# EAGLE design pypl (EAGLE 9.6.2)
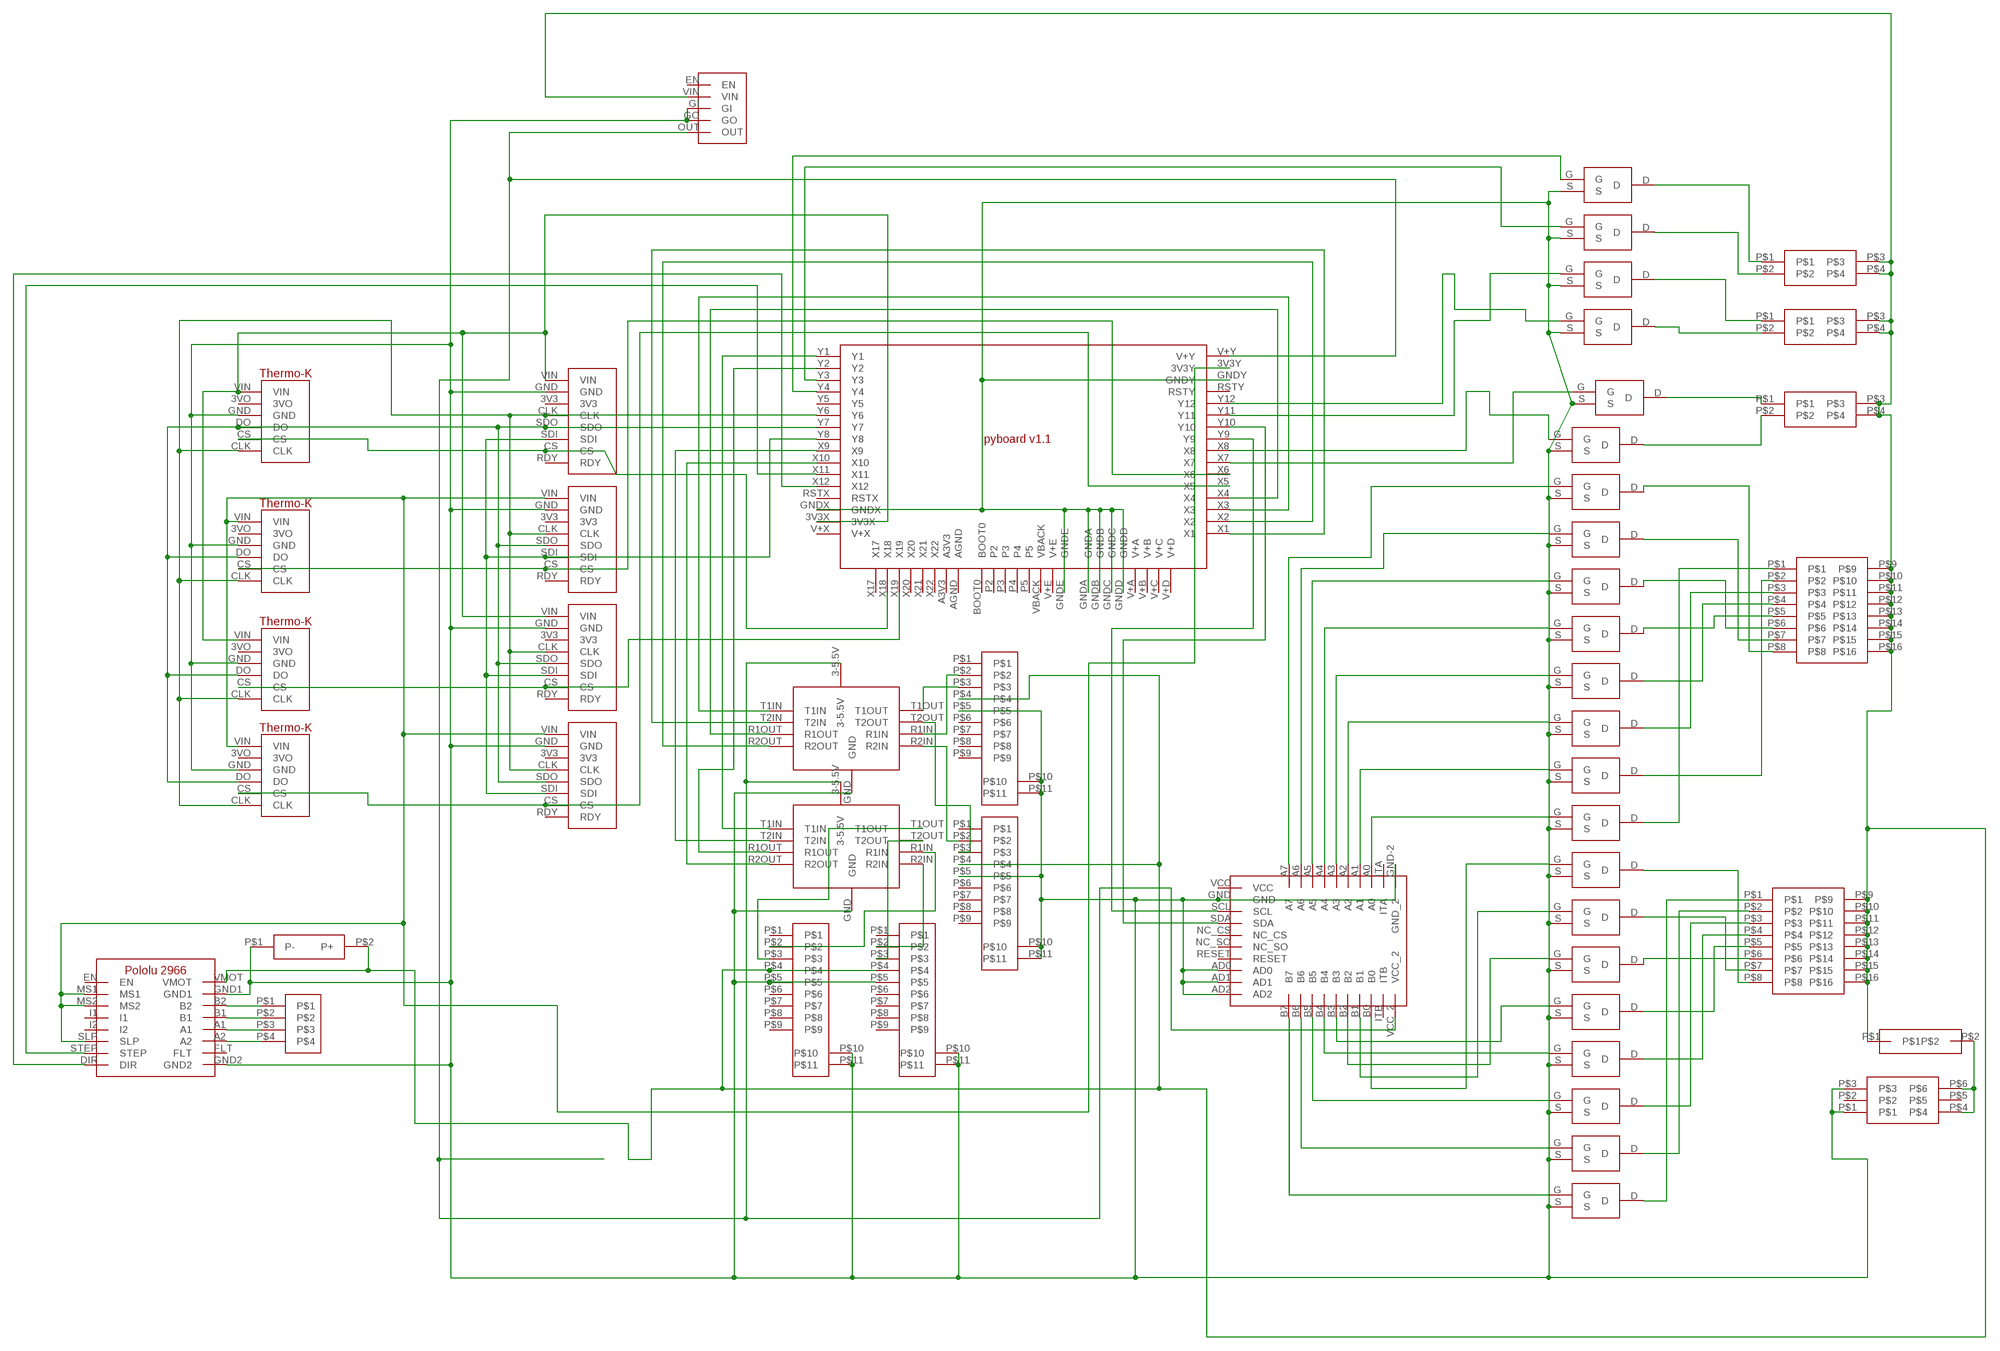
[diagram p0: schematic, sheet 1]

## Parts
U$1  MAX31865  [MAX31865]
U$2  IRLB8721PBF  [IRLB8721PBF]
U$3  IRLB8721PBF  [IRLB8721PBF]
U$4  IRLB8721PBF  [IRLB8721PBF]
U$5  IRLB8721PBF  [IRLB8721PBF]
U$6  IRLB8721PBF  [IRLB8721PBF]
U$7  IRLB8721PBF  [IRLB8721PBF]
U$8  IRLB8721PBF  [IRLB8721PBF]
U$9  IRLB8721PBF  [IRLB8721PBF]
U$10  MCP23017  [MCP23017]
U$11  IRLB8721PBF  [IRLB8721PBF]
U$12  IRLB8721PBF  [IRLB8721PBF]
U$13  IRLB8721PBF  [IRLB8721PBF]
U$14  IRLB8721PBF  [IRLB8721PBF]
U$15  IRLB8721PBF  [IRLB8721PBF]
U$16  IRLB8721PBF  [IRLB8721PBF]
U$17  IRLB8721PBF  [IRLB8721PBF]
U$18  IRLB8721PBF  [IRLB8721PBF]
U$19  DSUB-9  [DSUB-9]
U$20  DSUB-9  [DSUB-9]
U$21  DSUB-9  [DSUB-9]
U$22  DSUB-9  [DSUB-9]
U$23  MAX31865  [MAX31865]
U$24  PYBOARD_V1.1  [PYBOARD_V1.1]
U$25  MAX31865  [MAX31865]
U$26  MAX31865  [MAX31865]
U$27  BORNIER_DUPLEX_X16  [BORNIER_DUPLEX_X16]
U$28  BORNIER_DUPLEX_X16  [BORNIER_DUPLEX_X16]
U$29  CAP-GOTRONIC-04936  [CAP-GOTRONIC-04936]
U$30  BORNIER_1X4_2.54  [BORNIER_1X4_2.54]
U$31  PORTE-FUSIBLE  [PORTE-FUSIBLE]
U$32  MP6500-2966  [MP6500-2966]
U$33  IRLB8721PBF  [IRLB8721PBF]
U$34  IRLB8721PBF  [IRLB8721PBF]
U$35  BORNIER_DUPLEX_X4  [BORNIER_DUPLEX_X4]
U$36  BOB-1189  [BOB-11189]
U$37  BOB-1189  [BOB-11189]
U$38  MOLEX_MINIFT_JR_ANGLED_X6  [MOLEX_MINIFT_JR_ANGLED_X6]
U$39  D24V50F5D24V50F5  [D24V50F5]
U$40  BORNIER_DUPLEX_X4  [BORNIER_DUPLEX_X4]
U$41  BORNIER_DUPLEX_X4  [BORNIER_DUPLEX_X4]
U$42  IRLB8721PBF  [IRLB8721PBF]
U$43  IRLB8721PBF  [IRLB8721PBF]
U$44  IRLB8721PBF  [IRLB8721PBF]
U$45  IRLB8721PBF  [IRLB8721PBF]
U$46  MAX31855  [MAX31855]
U$47  MAX31855  [MAX31855]
U$48  MAX31855  [MAX31855]
U$49  MAX31855  [MAX31855]

## Nets
GND: U$1.GND U$2.S U$3.S U$4.S U$5.S U$6.S U$7.S U$8.S U$9.S U$10.AD0 U$10.AD1 U$10.AD2 U$10.GND U$10.GND-2(GND_2) U$11.S U$12.S U$13.S U$14.S U$15.S U$16.S U$17.S U$18.S U$19.P$5 U$19.P$10 U$19.P$11 U$20.P$5 U$20.P$10 U$20.P$11 U$21.P$5 U$21.P$10 U$21.P$11 U$22.P$5 U$22.P$10 U$22.P$11 U$23.GND U$24.GNDA U$24.GNDB U$24.GNDC U$24.GNDD U$24.GNDE U$24.GNDX U$24.GNDY U$25.GND U$26.GND U$29.P$1(P-) U$32.GND1 U$32.GND2 U$33.S U$34.S U$36.GND U$37.GND U$38.P$1 U$38.P$3 U$39.GI U$39.GO U$42.S U$43.S U$44.S U$45.S U$46.GND U$47.GND U$48.GND U$49.GND
N$1: U$24.X12 U$32.DIR
N$2: U$10.SDA U$24.Y10
N$3: U$10.SCL U$24.Y9
N$4: U$24.X4 U$36.R1OUT
N$5: U$24.X3 U$36.T1IN
N$6: U$24.X2 U$36.R2OUT
N$7: U$24.X1 U$36.T2IN
N$8: U$24.Y1 U$37.T1IN
N$9: U$24.Y2 U$37.R1OUT
N$10: U$24.X10 U$37.R2OUT
N$11: U$24.X9 U$37.T2IN
N$12: U$1.CLK U$23.CLK U$24.Y6 U$25.CLK U$26.CLK U$46.CLK U$47.CLK U$48.CLK U$49.CLK
N$13: U$1.SDO U$23.SDO U$24.Y7 U$25.SDO U$26.SDO U$46.DO U$47.DO U$48.DO U$49.DO
N$14: U$1.SDI U$23.SDI U$24.Y8 U$25.SDI U$26.SDI
N$15: U$10.B7 U$18.G
N$16: U$4.G U$10.A4
N$17: U$7.G U$10.A7
N$18: U$6.G U$10.A6
N$19: U$5.G U$10.A5
N$20: U$3.G U$10.A3
N$21: U$2.G U$10.A2
N$22: U$8.G U$10.A1
N$23: U$9.G U$10.A0
N$24: U$10.B6 U$17.G
N$25: U$10.B5 U$11.G
N$26: U$10.B4 U$12.G
N$27: U$10.B3 U$13.G
N$28: U$10.B2 U$14.G
N$29: U$10.B1 U$15.G
N$30: U$10.B0 U$16.G
N$31: U$7.D U$28.P$8
N$32: U$6.D U$28.P$7
N$33: U$5.D U$28.P$6
N$34: U$30.P$1 U$32.B2
N$35: U$16.D U$27.P$8
N$36: U$15.D U$27.P$7
N$37: U$4.D U$28.P$5
N$38: U$3.D U$28.P$4
N$39: U$2.D U$28.P$3
N$40: U$8.D U$28.P$2
N$41: U$9.D U$28.P$1
N$42: U$14.D U$27.P$6
N$43: U$13.D U$27.P$5
N$44: U$12.D U$27.P$4
N$45: U$11.D U$27.P$3
N$46: U$17.D U$27.P$2
N$47: U$18.D U$27.P$1
N$49: U$40.P$2 U$42.D
N$50: U$10.VCC_2 U$24.V+Y U$36.3-5.5V U$37.3-5.5V U$39.OUT
N$51: U$31.P$2 U$38.P$4 U$38.P$6
N$52: U$24.X6 U$26.CS U$47.CS
N$53: U$1.CS U$24.X19 U$48.CS
N$54: U$24.X18 U$25.CS U$46.CS
N$55: U$24.X7 U$34.G
N$56: U$24.X8 U$33.G
N$57: U$33.D U$35.P$2
N$58: U$34.D U$35.P$1
N$59: U$30.P$2 U$32.B1
N$60: U$30.P$3 U$32.A1
N$61: U$30.P$4 U$32.A2
N$62: U$19.P$2 U$36.R1IN
N$63: U$20.P$2 U$36.R2IN
N$64: U$40.P$1 U$43.D
N$65: U$21.P$2 U$37.R2IN
N$66: U$22.P$2 U$37.R1IN
N$67: U$19.P$3 U$36.T1OUT
N$68: U$20.P$3 U$36.T2OUT
N$69: U$22.P$3 U$37.T1OUT
N$70: U$21.P$3 U$37.T2OUT
N$71: U$1.VIN U$24.3V3X U$25.VIN U$46.VIN U$48.VIN
N$72: U$23.CS U$24.X5 U$49.CS
N$73: U$41.P$2 U$44.D
N$75: U$19.P$4 U$20.P$4 U$21.P$4 U$22.P$4 U$27.P$9 U$27.P$10 U$27.P$11 U$27.P$12 U$27.P$13 U$27.P$14 U$27.P$15 U$27.P$16 U$28.P$9 U$28.P$10 U$28.P$11 U$28.P$12 U$28.P$13 U$28.P$14 U$28.P$15 U$28.P$16 U$29.P$2(P+) U$31.P$1 U$32.VMOT U$35.P$3 U$35.P$4 U$39.VIN U$40.P$3 U$40.P$4 U$41.P$3 U$41.P$4
N$79: U$24.X11 U$32.STEP
N$80: U$23.VIN U$24.3V3Y U$26.VIN U$32.MS1 U$32.MS2 U$32.SLP U$47.VIN U$49.VIN
N$81: U$41.P$1 U$45.D
N$82: U$24.Y11 U$43.G
N$83: U$24.Y12 U$42.G
N$84: U$24.Y3 U$44.G
N$85: U$24.Y4 U$45.G
Unconnected: U$1.3V3 U$1.RDY U$10.ITA U$10.ITB U$10.NC_CS U$10.NC_SO U$10.RESET U$10.VCC U$19.P$1 U$19.P$6 U$19.P$7 U$19.P$8 U$19.P$9 U$20.P$1 U$20.P$6 U$20.P$7 U$20.P$8 U$20.P$9 U$21.P$1 U$21.P$6 U$21.P$7 U$21.P$8 U$21.P$9 U$22.P$1 U$22.P$6 U$22.P$7 U$22.P$8 U$22.P$9 U$23.3V3 U$23.RDY U$24.A3V3 U$24.AGND U$24.BOOT0 U$24.P2 U$24.P3 U$24.P4 U$24.P5 U$24.RSTX U$24.RSTY U$24.V+A U$24.V+B U$24.V+C U$24.V+D U$24.V+E U$24.V+X U$24.VBACK U$24.X17 U$24.X20 U$24.X21 U$24.X22 U$24.Y5 U$25.3V3 U$25.RDY U$26.3V3 U$26.RDY U$32.EN U$32.FLT U$32.I1 U$32.I2 U$38.P$2 U$38.P$5 U$39.EN U$46.3VO U$47.3VO U$48.3VO U$49.3VO

## Library data of the parts
U$1 U$23 U$25 U$26 = mathieu:MAX31865
U$2-U$9 U$11-U$18 U$33 U$34 U$42-U$45 = mathieu:IRLB8721PBF
U$10 = mathieu:MCP23017
U$19-U$22 = mathieu:DSUB-9
U$24 = mathieu:PYBOARD_V1.1
U$27 U$28 = mathieu:BORNIER_DUPLEX_X16
U$29 = mathieu:CAP-GOTRONIC-04936
U$30 = mathieu:BORNIER_1X4_2.54
U$31 = mathieu:PORTE-FUSIBLE
U$32 = mathieu:MP6500-2966
U$35 U$40 U$41 = mathieu:BORNIER_DUPLEX_X4
U$36 U$37 = mathieu:BOB-1189
U$38 = mathieu:MOLEX_MINIFT_JR_ANGLED_X6
U$39 = mathieu:D24V50F5
U$46-U$49 = mathieu:MAX31855

## Board
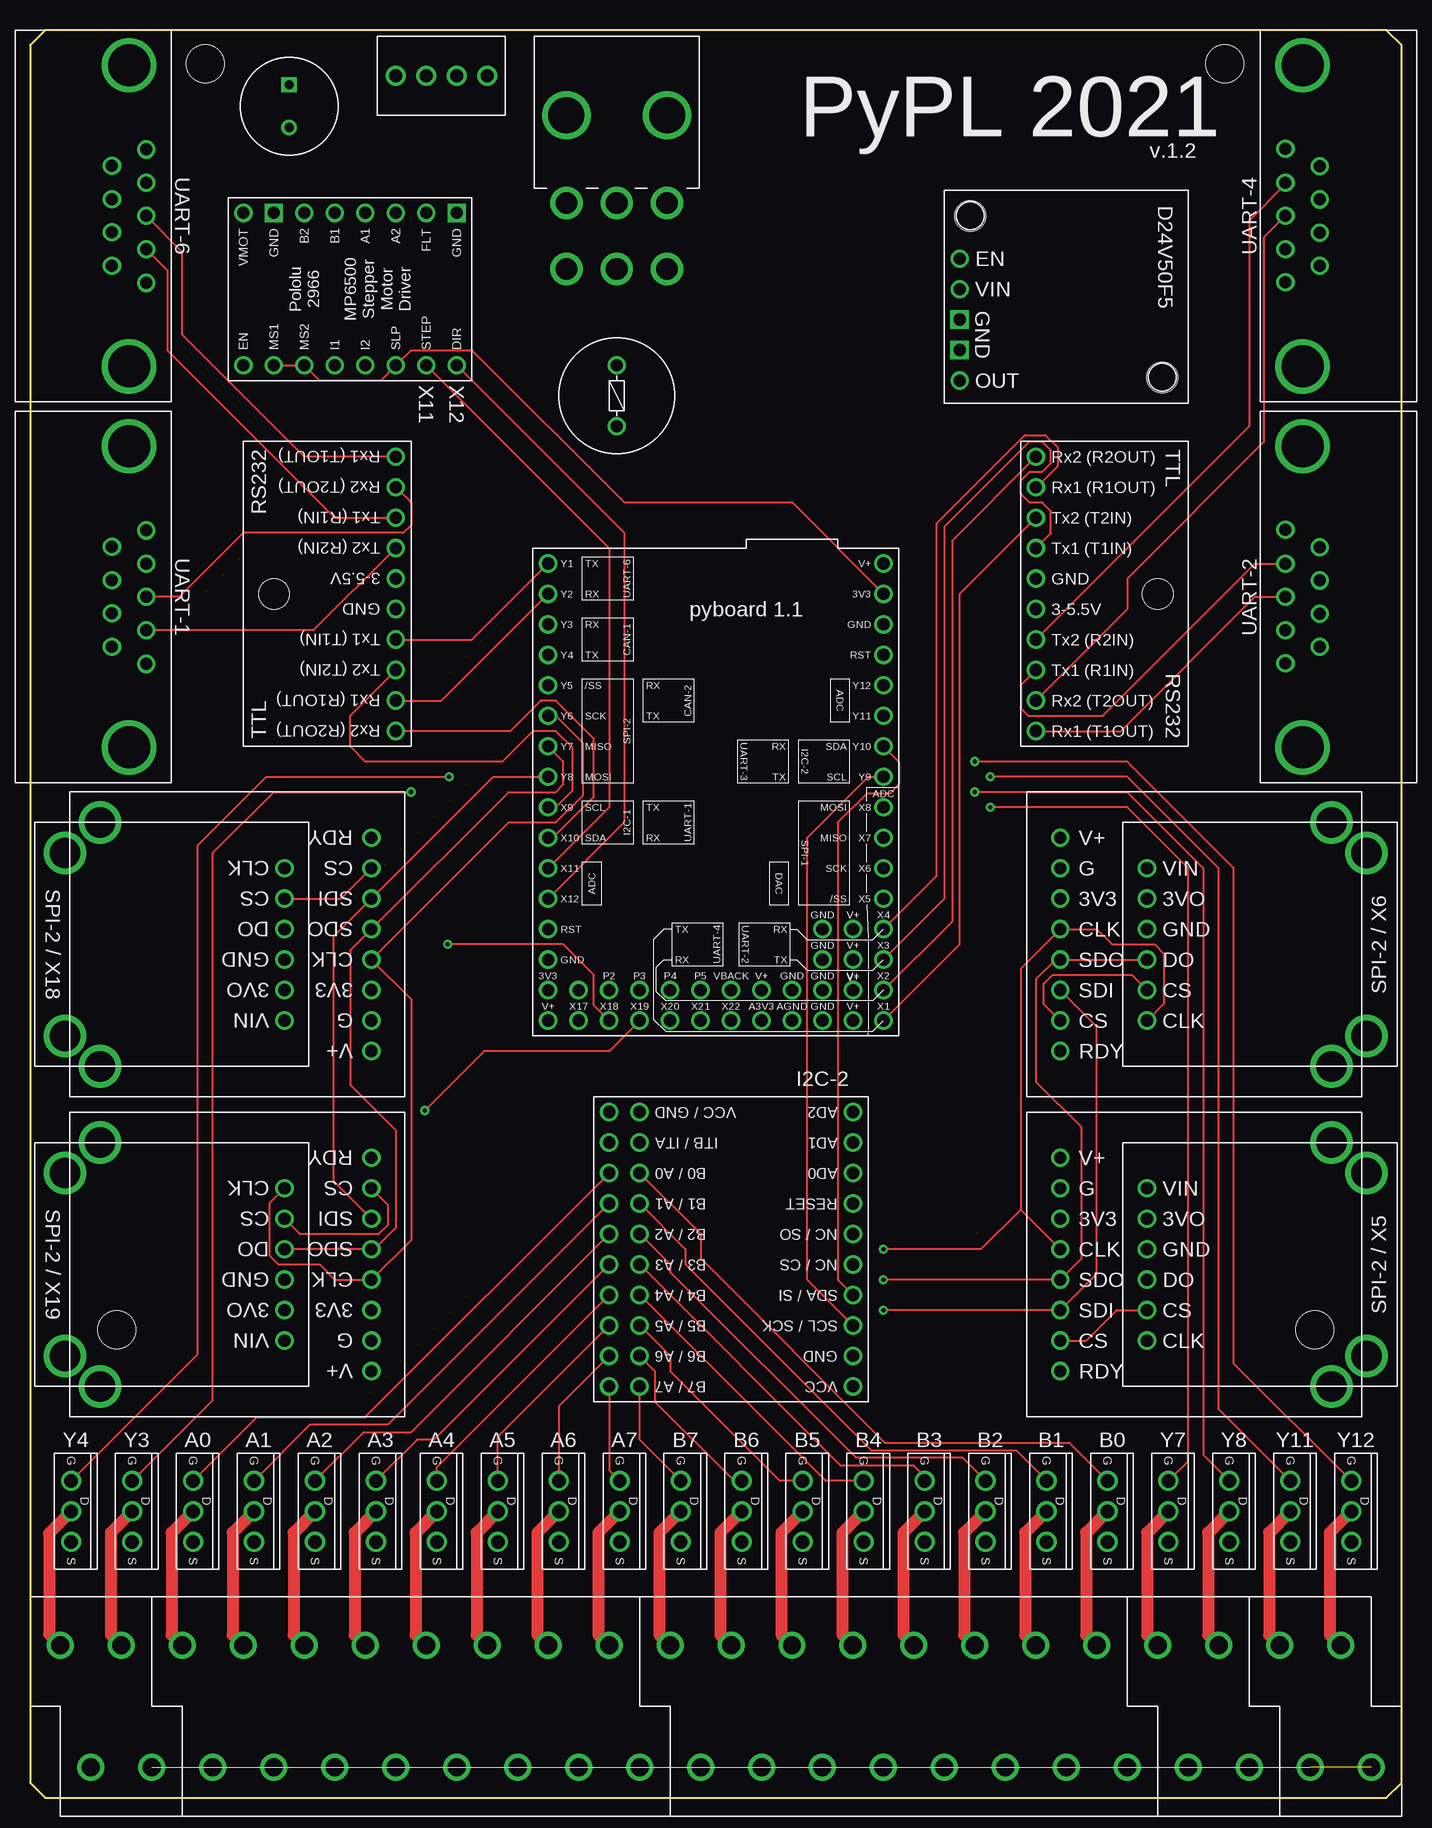
[diagram p1: board, top side]
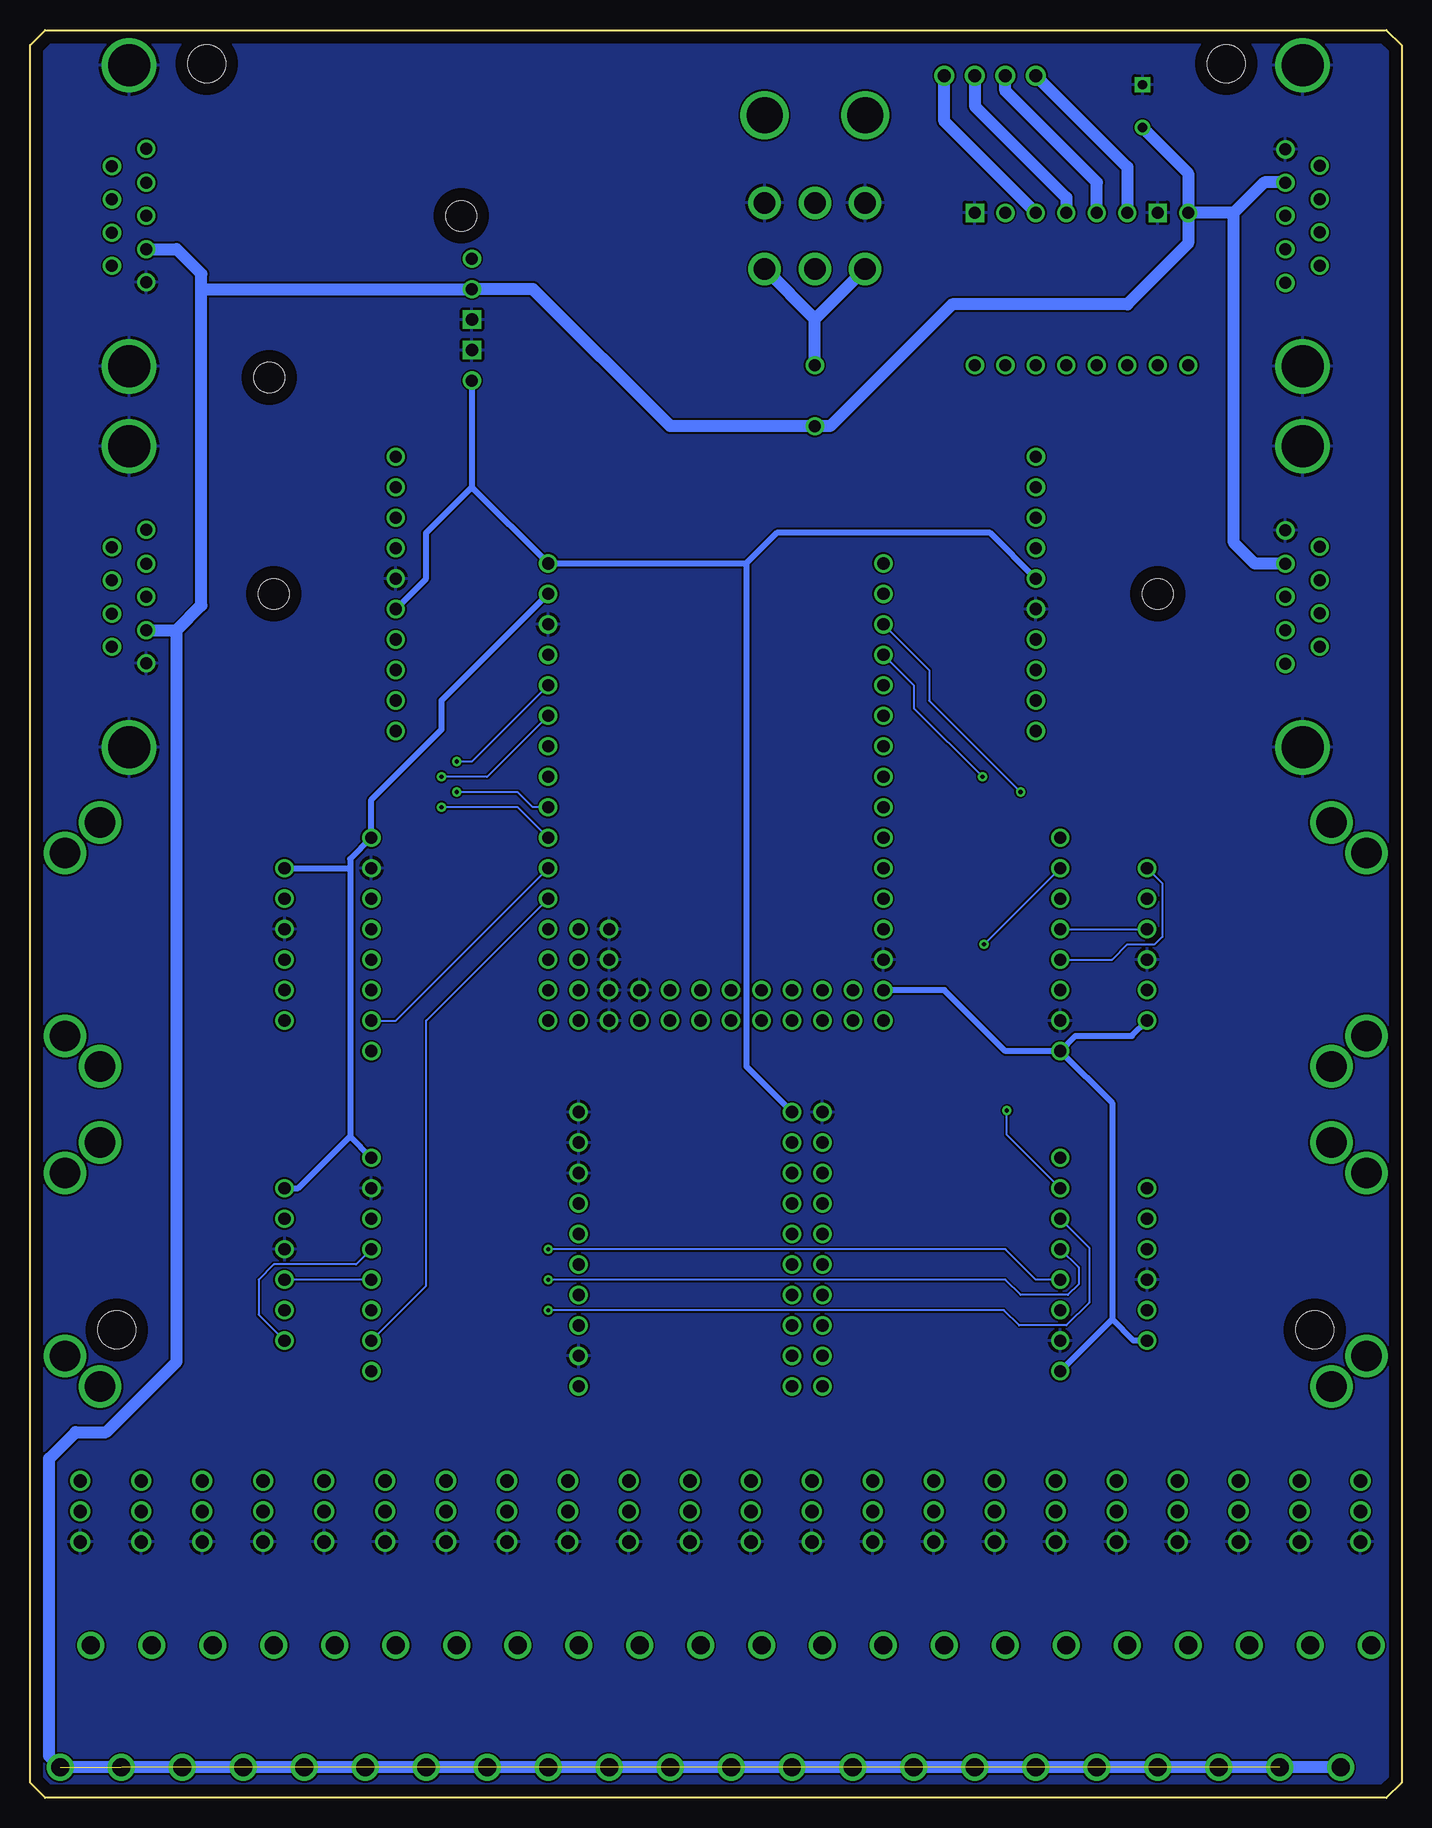
[diagram p2: board, bottom side, seen from below]

Size 114.3 x 147.32 mm. Coordinates in mm from the lower left corner, seen from the top.
Outline: 0,146.05 0,1.27 1.27,0 113.03,0 114.3,1.27 114.3,146.05 113.03,147.32 1.27,147.32 0,146.05
Copper layers (1*16): Top 0.035mm / dielectric 1.5mm / Bottom 0.035mm
Design rules "default": minimum track width 6mil, minimum drill 0.35mm, track to track 6mil, track to pad 6mil, pad to pad 6mil, via to via 6mil, smd to smd 6mil, copper to edge 40mil, drill to drill 6mil, minimum pad ring 10mil, minimum via ring 8mil, stop-mask expansion 4mil, vias tented up to drill 0mil, thermal gap 10mil
Holes 2.54 mm at 20.32,100.33 93.98,100.33 94.36,118.36 78.36,131.83
Holes 3.15 mm at 14.61,144.53 99.57,144.53 7.24,38.99 107.06,38.99

### Footprints (pad centres in the part's own frame; a part is rotated, then mirrored left to right if it is on the bottom)
MAX31865 = drill 1.02: 3V3 -3.81,-11.176; CLK -1.27,-11.176; CS 6.35,-11.176; GND -6.35,-11.176; RDY 8.89,-11.176; SDI 3.81,-11.176; SDO 1.27,-11.176; VIN -8.89,-11.176 | drill 2.54: P$1 -10.16,11.43; P$2 10.16,11.43
IRLB8721PBF = drill 1.118: D 0,0; G -2.54,0; S 2.54,0
MCP23017 = drill 1.02: A0 8.89,-6.35; A1 8.89,-3.81; A2 8.89,-1.27; A3 8.89,1.27; A4 8.89,3.81; A5 8.89,6.35; A6 8.89,8.89; A7 8.89,11.43; AD0 -11.43,-6.35; AD1 -11.43,-8.89; AD2 -11.43,-11.43; B0 6.35,-6.35; B1 6.35,-3.81; B2 6.35,-1.27; B3 6.35,1.27; B4 6.35,3.81; B5 6.35,6.35; B6 6.35,8.89; B7 6.35,11.43; GND -11.43,8.89; GND-2 8.89,-11.43; ITA 8.89,-8.89; ITB 6.35,-8.89; NC_CS -11.43,1.27; NC_SO -11.43,-1.27; RESET -11.43,-3.81; SCL -11.43,6.35; SDA -11.43,3.81; VCC -11.43,11.43; VCC_2 6.35,-11.43
DSUB-9 = drill 1: P$1 5.588,1.422; P$2 2.769,1.422; P$3 0,1.422; P$4 -2.769,1.422; P$5 -5.537,1.422; P$6 4.14,-1.422; P$7 1.372,-1.422; P$8 -1.397,-1.422; P$9 -4.166,-1.422 | drill 3.5: P$10 -12.548,0; P$11 12.548,0
PYBOARD_V1.1 = drill 1.02: 3V3X -13.97,-16.51; 3V3Y 13.97,16.51; A3V3 3.81,-19.05; AGND 6.35,-19.05; BOOT0 -11.43,-16.51; GNDA 8.89,-11.43; GNDB 8.89,-13.97; GNDC 8.89,-16.51; GNDD 8.89,-19.05; GNDE 6.35,-16.51; GNDX -13.97,-13.97; GNDY 13.97,13.97; P2 -8.89,-16.51; P3 -6.35,-16.51; P4 -3.81,-16.51; P5 -1.27,-16.51; RSTX -13.97,-11.43; RSTY 13.97,11.43; V+A 11.43,-11.43; V+B 11.43,-13.97; V+C 11.43,-16.51; V+D 11.43,-19.05; V+E 3.81,-16.51; V+X -13.97,-19.05; V+Y 13.97,19.05; VBACK 1.27,-16.51; X1 13.97,-19.05; X2 13.97,-16.51; X3 13.97,-13.97; X4 13.97,-11.43; X5 13.97,-8.89; X6 13.97,-6.35; X7 13.97,-3.81; X8 13.97,-1.27; X9 -13.97,-1.27; X10 -13.97,-3.81; X11 -13.97,-6.35; X12 -13.97,-8.89; X17 -11.43,-19.05; X18 -8.89,-19.05; X19 -6.35,-19.05; X20 -3.81,-19.05; X21 -1.27,-19.05; X22 1.27,-19.05; Y1 -13.97,19.05; Y2 -13.97,16.51; Y3 -13.97,13.97; Y4 -13.97,11.43; Y5 -13.97,8.89; Y6 -13.97,6.35; Y7 -13.97,3.81; Y8 -13.97,1.27; Y9 13.97,1.27; Y10 13.97,3.81; Y11 13.97,6.35; Y12 13.97,8.89
BORNIER_DUPLEX_X16 = drill 1.499: P$1 -19.05,5.08; P$2 -13.97,5.08; P$3 -8.89,5.08; P$4 -3.81,5.08; P$5 1.27,5.08; P$6 6.35,5.08; P$7 11.43,5.08; P$8 16.51,5.08; P$9 -16.51,-5.08; P$10 -11.43,-5.08; P$11 -6.35,-5.08; P$12 -1.27,-5.08; P$13 3.81,-5.08; P$14 8.89,-5.08; P$15 13.97,-5.08; P$16 19.05,-5.08
CAP-GOTRONIC-04936 = drill 0.762 square: P$1 -1.778,0 | drill 0.762: P$2 1.778,0
BORNIER_1X4_2.54 = drill 1.1: P$1 -3.81,0; P$2 -1.27,0; P$3 1.27,0; P$4 3.81,0
PORTE-FUSIBLE = drill 1.02: P$1 -2.54,0; P$2 2.54,0
MP6500-2966 = drill 1.016: A1 13.97,8.89; A2 13.97,6.35; B1 13.97,11.43; B2 13.97,13.97; DIR 1.27,1.27; EN 1.27,19.05; FLT 13.97,3.81; I1 1.27,11.43; I2 1.27,8.89; MS1 1.27,16.51; MS2 1.27,13.97; SLP 1.27,6.35; STEP 1.27,3.81; VMOT 13.97,19.05 | drill 1.016 square: GND1 13.97,16.51; GND2 13.97,1.27
BORNIER_DUPLEX_X4 = drill 1.499: P$1 -3.81,5.08; P$2 1.27,5.08; P$3 -1.27,-5.08; P$4 3.81,-5.08
BOB-11189 = drill 1.02: 3-5.5V 1.27,-6.35; GND -1.27,-6.35; R1IN 6.35,-6.35; R1OUT -8.89,-6.35; R2IN 3.81,-6.35; R2OUT -11.43,-6.35; T1IN -3.81,-6.35; T1OUT 11.43,-6.35; T2IN -6.35,-6.35; T2OUT 8.89,-6.35
MOLEX_MINIFT_JR_ANGLED_X6 = drill 1.803: P$1 4.191,7.29; P$2 0,7.29; P$3 -4.191,7.29; P$4 4.191,12.802; P$5 0,12.802; P$6 -4.191,12.802 | drill 2.997: P$7 4.191,0; P$8 -4.191,0
D24V50F5 = drill 1: EN -3.175,-8.89; OUT 6.985,-8.89; VIN -0.635,-8.89 | drill 1.016 square: GI 1.905,-8.89; GO 4.445,-8.89
MAX31855 = drill 1.02: 3VO -3.81,-6.858; CLK 6.35,-6.858; CS 3.81,-6.858; DO 1.27,-6.858; GND -1.27,-6.858; VIN -6.35,-6.858 | drill 2.54: P$1 -7.62,11.43; P$2 7.62,11.43

### Placement (x,y rotation side)
U$1  17.27,44.45 90 top
U$2  23.75,23.88 270 top
U$3  28.83,23.88 270 top
U$4  33.91,23.88 270 top
U$5  38.99,23.88 270 top
U$6  44.07,23.88 270 top
U$7  49.15,23.88 270 top
U$8  18.67,23.88 270 top
U$9  13.59,23.88 270 top
U$10  57.15,45.72 180 top
U$11  64.39,23.88 270 top
U$12  69.47,23.88 270 top
U$13  74.55,23.88 270 top
U$14  79.63,23.88 270 top
U$15  84.71,23.88 270 top
U$16  89.79,23.88 270 top
U$17  59.31,23.88 270 top
U$18  54.23,23.88 270 top
U$19  106.05,100.08 90 top
U$20  106.05,131.83 90 top
U$21  8.26,100.08 270 top
U$22  8.26,131.83 270 top
U$23  97.03,44.45 270 top
U$24  57.15,83.82 0 top
U$25  17.27,71.12 90 top
U$26  97.03,71.12 270 top
U$27  72.39,7.62 0 top
U$28  31.75,7.62 0 top
U$29  21.59,140.97 270 top
U$30  34.29,143.51 0 top
U$31  48.9,116.84 90 top
U$32  36.83,118.11 90 top
U$33  99.95,23.88 270 top
U$34  94.87,23.88 270 top
U$35  97.79,7.62 0 top
U$36  90.17,100.33 270 top
U$37  24.13,100.33 90 top
U$38  48.9,140.21 180 top
U$39  86.36,125.09 270 top
U$40  107.95,7.62 0 top
U$41  6.35,7.62 0 top
U$42  110.11,23.88 270 top
U$43  105.03,23.88 270 top
U$44  8.51,23.88 270 top
U$45  3.43,23.88 270 top
U$46  14.35,71.12 90 top
U$47  99.95,71.12 270 top
U$48  14.35,44.45 90 top
U$49  99.95,44.45 270 top

### Tracks (layer width: path | path; a pad name or v marks a point on that pad's centre or on a via)
GND
  pour Bottom: -3.81,149.86 116.84,149.86 116.84,-2.54 116.84,-3.81 -2.54,-3.81 -3.81,-3.81
N$1
  Top 0.152: U$32.DIR 49.53,105.41 49.53,81.28 U$24.X12
N$2
  Top 0.152: U$10.SDA 67.31,43.18 67.31,81.28 69.72,83.69 71.63,83.69 72.39,84.45 72.39,86.36 U$24.Y10
N$3
  Top 0.152: U$10.SCL 64.77,43.18 64.77,80.01 69.85,85.09 U$24.Y9
N$4
  Top 0.152: U$24.X4 75.56,76.83 75.56,106.23 82.9,113.57 84.61,113.57 85.63,112.55 85.63,110.97 83.88,109.22 U$36.R1OUT
N$5
  Top 0.152: U$24.X3 76.2,74.93 76.2,105.93 83.28,113.01 84.36,113.01 85.07,112.3 85.07,111.22 84.36,110.51 83.33,110.51 82.57,109.76 82.57,108.68 83.33,107.93 84.36,107.93 85.07,107.22 85.07,105.38 U$36.T1IN
N$6
  Top 0.152: U$24.X2 76.83,73.03 76.83,104.78 U$36.R2OUT
N$7
  Top 0.152: U$36.T2IN 77.47,100.33 77.47,71.12 U$24.X1
N$8
  Top 0.152: U$24.Y1 36.83,96.52 U$37.T1IN
N$9
  Top 0.152: U$24.Y2 34.29,91.44 U$37.R1OUT
N$10
  Top 0.152: U$24.X10 43.56,80.01 46.99,83.44 46.99,88.27 43.81,91.44 42.55,91.44 40.01,88.9 U$37.R2OUT
N$11
  Top 0.152: U$24.X9 43.81,82.55 45.21,83.95 45.21,87.5 43.81,88.9 41.91,88.9 39.37,86.36 27.94,86.36 26.67,87.63 26.67,90.17 U$37.T2IN
N$12  (via drill 0.35)
  Top 0.152: U$24.Y6 43.81,90.17 46.1,87.88 46.1,83.57 43.81,81.28 39.88,81.28 U$25.CLK 31.75,66.55 31.75,46.48 U$1.CLK 25.4,43.18 24.13,44.45 20.7,44.45 19.94,45.21 19.94,49.53 U$48.CLK | 82.55,49.02 82.55,69.09 U$26.CLK 88.9,72.39 90.17,71.12 93.73,71.12 94.49,70.36 94.49,66.17 U$47.CLK | U$23.CLK 82.55,49.02 | 82.55,49.02 79.25,45.72 v71.12,45.72
  Bottom 0.152: U$25.CLK 24.13,69.85 22.86,71.12 20.57,71.12 19.94,71.75 19.94,76.2 U$46.CLK | U$23.CLK 87.12,44.45 93.98,44.45 95.25,43.18 95.25,40.26 U$49.CLK | U$1.CLK 30.48,43.18 33.02,45.72 v71.12,45.72
N$13  (via drill 0.35)
  Top 0.152: U$24.Y7 44.45,86.36 44.45,84.45 43.81,83.82 39.88,83.82 U$25.SDO 26.67,70.61 26.67,59.44 30.48,55.63 30.48,47.5 28.7,45.72 U$1.SDO U$48.DO | U$47.DO U$26.SDO 85.47,69.85 83.82,68.2 83.82,59.69 87.63,55.88 87.63,44.96 U$23.SDO v71.12,43.18
  Bottom 0.152: U$25.SDO U$46.DO | U$23.SDO U$49.DO | U$1.SDO 26.92,44.2 26.92,42.8 27.81,41.91 31.75,41.91 33.02,43.18 v71.12,43.18
N$14  (via drill 0.35)
  Top 0.152: U$24.Y8 38.61,85.09 U$25.SDI 25.27,71.75 25.27,51.44 U$1.SDI | U$26.SDI 88.9,64.26 88.9,43.69 U$23.SDI v71.12,40.64
  Bottom 0.152: U$1.SDI 26.04,45.85 26.04,41.27 27.94,39.37 31.88,39.37 33.15,40.64 v71.12,40.64
N$15
  Top 0.152: U$18.G 50.8,29.84 U$10.B7
N$16
  Top 0.152: U$4.G 33.91,27.56 U$10.A4
N$17
  Top 0.152: U$7.G 48.26,27.3 U$10.A7
N$18
  Top 0.152: U$6.G 44.07,32.64 U$10.A6
N$19
  Top 0.152: U$5.G 38.99,30.1 U$10.A5
N$20
  Top 0.152: U$10.A3 33.66,29.84 32.26,29.84 U$3.G
N$21
  Top 0.152: U$2.G 27.81,30.48 31.75,30.48 U$10.A2
N$22
  Top 0.152: U$8.G 23.37,31.11 29.84,31.11 U$10.A1
N$23
  Top 0.152: U$9.G 18.92,31.75 27.94,31.75 U$10.A0
N$24
  Top 0.152: U$10.B6 52.07,35.56 52.07,33.02 58.67,26.42 U$17.G
N$25
  Top 0.152: U$10.B5 53.34,36.83 53.34,35.56 62.48,26.42 U$11.G
N$26
  Top 0.152: U$12.G 66.29,26.42 U$10.B4
N$27
  Top 0.152: U$13.G 74.55,26.8 73.66,27.69 67.56,27.69 U$10.B3
N$28
  Top 0.152: U$14.G 77.72,28.32 68.83,28.32 53.34,43.81 53.34,44.45 U$10.B2
N$29
  Top 0.152: U$10.B1 54.61,45.72 54.61,44.45 70.1,28.96 82.17,28.96 U$15.G
N$30
  Top 0.152: U$10.B0 55.88,46.99 55.88,44.96 71.25,29.59 86.61,29.59 U$16.G
N$31
  Top 1.016: U$7.D 47.37,22.1 47.37,13.59 U$28.P$8
N$32
  Top 1.016: U$6.D 42.29,22.1 42.29,13.59 U$28.P$7
N$33
  Top 1.016: U$5.D 37.21,22.1 37.21,13.59 U$28.P$6
N$34
  Bottom 1.016: U$30.P$1 22.86,135.89 U$32.B2
N$35
  Top 1.016: U$16.D 88.01,22.1 88.01,13.59 U$27.P$8
N$36
  Top 1.016: U$15.D 82.93,22.1 82.93,13.59 U$27.P$7
N$37
  Top 1.016: U$4.D 32.13,22.1 32.13,13.59 U$28.P$5
N$38
  Top 1.016: U$3.D 27.05,22.1 27.05,13.59 U$28.P$4
N$39
  Top 1.016: U$2.D 21.97,22.1 21.97,13.59 U$28.P$3
N$40
  Top 1.016: U$8.D 16.89,22.1 16.89,13.59 U$28.P$2
N$41
  Top 1.016: U$9.D 11.81,22.1 11.81,13.59 U$28.P$1
N$42
  Top 1.016: U$14.D 77.85,22.1 77.85,13.59 U$27.P$6
N$43
  Top 1.016: U$13.D 72.77,22.1 72.77,13.59 U$27.P$5
N$44
  Top 1.016: U$12.D 67.69,22.1 67.69,13.59 U$27.P$4
N$45
  Top 1.016: U$11.D 62.61,22.1 62.61,13.59 U$27.P$3
N$46
  Top 1.016: U$17.D 57.53,22.1 57.53,13.59 U$27.P$2
N$47
  Top 1.016: U$18.D 52.45,22.1 52.45,13.59 U$27.P$1
N$49
  Top 1.016: U$42.D 108.33,22.1 108.33,13.59 U$40.P$2
N$50
  Bottom 0.508: U$39.OUT 77.47,109.22 | 77.47,109.22 U$24.V+Y 54.61,102.87 | U$36.3-5.5V 81.28,101.6 81.28,105.41 77.47,109.22 | U$37.3-5.5V 34.29,105.41 52.07,105.41 54.61,102.87 | 54.61,102.87 54.61,60.96 U$10.VCC_2
N$51
  Bottom 1.016: U$31.P$2 48.9,123.22 | 48.9,123.22 U$38.P$4 | U$38.P$6 48.9,123.22
N$52
  Top 0.152: U$26.CS 84.48,66.14 84.48,67.85 85.21,68.58 91.82,68.58 U$47.CS
  Bottom 0.152: U$26.CS 83.82,64.77 U$24.X6
N$53  (via drill 0.35)
  Top 0.152: U$24.X19 48.26,62.23 37.85,62.23 v32.89,57.28 | U$48.CS 22.48,46.99 29.08,46.99 29.84,47.75 29.84,49.4 U$1.CS
  Bottom 0.152: U$1.CS 32.89,55.24 v32.89,57.28
N$54  (via drill 0.35)
  Top 0.152: U$24.X18 46.99,66.04 46.99,68.58 44.45,71.12 v34.8,71.12 | U$25.CS 25.91,74.93 U$46.CS
  Bottom 0.152: v34.8,71.12 U$25.CS
N$55  (via drill 0.35)
  Top 0.152: U$34.G 96.52,28.07 96.52,77.47 91.44,82.55 v80.01,82.55
  Bottom 0.152: U$24.X7 73.66,82.55 v80.01,82.55
N$56  (via drill 0.35)
  Top 0.152: U$33.G 97.79,28.57 97.79,77.47 91.44,83.82 v78.74,83.82
  Bottom 0.152: U$24.X8 72.39,82.55 73.66,83.82 v78.74,83.82
N$57
  Top 1.016: U$33.D 98.17,22.1 98.17,13.59 U$35.P$2
N$58
  Top 1.016: U$34.D 93.09,22.1 93.09,13.59 U$35.P$1
N$59
  Bottom 1.016: U$32.B1 25.4,134.62 33.02,142.24 U$30.P$2
N$60
  Bottom 1.016: U$30.P$3 35.56,140.97 27.94,133.35 U$32.A1
N$61
  Bottom 1.016: U$32.A2 38.1,139.7 U$30.P$4
N$62
  Top 0.152: U$36.R1IN 82.55,92.71 82.55,90.81 83.19,90.17 89.41,90.17 102.08,102.84 U$19.P$2
N$63
  Top 0.152: U$20.P$2 104.62,134.47 101.6,131.44 101.6,114.3 U$36.R2IN
N$64
  Top 1.016: U$43.D 103.25,22.1 103.25,13.59 U$40.P$1
N$65
  Top 0.152: U$37.R2IN 23.62,97.28 9.7,97.28 U$21.P$2
N$66
  Top 0.152: U$22.P$2 11.43,127.31 11.43,120.65 25.4,106.68 U$37.R1IN
N$67
  Top 0.152: U$19.P$3 102.08,100.08 90.91,88.9 U$36.T1OUT
N$68
  Top 0.152: U$36.T2OUT 91.44,99.06 91.44,101.6 102.87,113.03 102.87,130.07 U$20.P$3
N$69
  Top 0.152: U$22.P$3 12.7,128.8 12.7,121.92 22.86,111.76 U$37.T1OUT
N$70
  Top 0.152: U$37.T2OUT 31.75,107.95 31.75,106.05 31.11,105.41 17.78,105.41 12.45,100.08 U$21.P$3
N$71
  Bottom 0.508: U$25.VIN 33.02,62.23 38.1,67.31 U$24.3V3X | U$25.VIN 24.13,57.91 24.13,39.88 | 24.13,39.88 U$1.VIN | U$25.VIN 27.18,63.5 22.48,63.5 U$46.VIN | 24.13,39.88 22.35,38.1 U$48.VIN
N$72
  Top 0.152: U$23.CS 88.01,38.1 90.55,40.64 U$49.CS
  Bottom 0.152: U$24.X5 81.28,64.77 81.28,42.67 U$23.CS
N$73
  Top 1.016: U$44.D 6.73,22.1 6.73,13.59 U$41.P$2
N$75  (20 unrouted)
  Bottom 1.016: U$32.VMOT 17.78,129.54 22.86,124.46 37.47,124.46 47.62,114.3 U$31.P$1 60.96,114.3 72.39,125.73 U$39.VIN 100.03,125.73 | U$29.P$2 17.78,135.38 U$32.VMOT | U$22.P$4 9.7,134.62 11.43,134.62 13.97,132.08 | 13.97,132.08 U$32.VMOT | U$21.P$4 12.22,102.84 13.97,104.6 13.97,132.08 | U$41.P$3 U$40.P$4 112.7,3.48 112.7,28.27 110.49,30.48 107.95,30.48 102.08,36.35 102.08,97.31 | U$20.P$4 102.08,129.06 100.03,127 100.03,125.73 | U$19.P$4 102.08,97.31 | 102.08,97.31 100.03,99.36 100.03,125.73
N$79
  Top 0.152: U$32.STEP 48.26,104.14 48.26,82.55 U$24.X11
N$80
  Top 0.152: U$32.MS1 U$32.MS2 24.13,118.11 29.21,118.11 U$32.SLP 31.75,120.65 36.83,120.65 49.53,107.95 63.5,107.95 U$24.3V3Y
  Bottom 0.508: U$24.3V3Y 80.01,91.44 80.01,89.03 85.85,83.19 U$26.VIN 87.63,78.23 87.63,77.47 | 87.63,55.12 U$23.VIN | 87.63,77.47 87.63,55.12 | U$47.VIN 87.63,77.47 | 87.63,55.12 91.95,50.8 U$49.VIN
N$81
  Top 1.016: U$45.D 1.6,22.05 1.6,13.64 U$41.P$1
N$82  (via drill 0.35)
  Top 0.152: U$43.G 99.06,32.38 99.06,77.47 91.44,85.09 v80.01,85.09
  Bottom 0.152: U$24.Y11 76.2,85.09 v80.01,85.09
N$83  (via drill 0.35)
  Top 0.152: U$42.G 100.33,36.2 100.33,77.47 91.44,86.36 v78.74,86.36
  Bottom 0.152: U$24.Y12 77.47,86.36 v78.74,86.36
N$84  (via drill 0.35)
  Top 0.152: U$44.G 15.24,33.15 15.24,78.74 20.32,83.82 v31.75,83.82
  Bottom 0.152: v31.75,83.82 39.37,91.44 39.37,93.98 U$24.Y3
N$85  (via drill 0.35)
  Top 0.152: U$45.G 13.97,36.96 13.97,79.38 19.68,85.09 v34.92,85.09
  Bottom 0.152: U$24.Y4 40.64,92.71 40.64,90.81 v34.92,85.09

### Text on the board
tNames: PyPL 2021 | v.1.2 | UART-6 | UART-4 | X11 | X12 | UART-1 | UART-2 | SPI-2 / X18 | SPI-2 / X6 | I2C-2 | SPI-2 / X19 | SPI-2 / X5 | Y4 | Y3 | A0 | A1 | A2 | A3 | A4 | A5 | A6 | A7 | B7 | B6 | B5 | B4 | B3 | B2 | B1 | B0 | Y7 | Y8 | Y11 | Y12